# EAGLE design LEDARRAY (EAGLE 8.6.0)
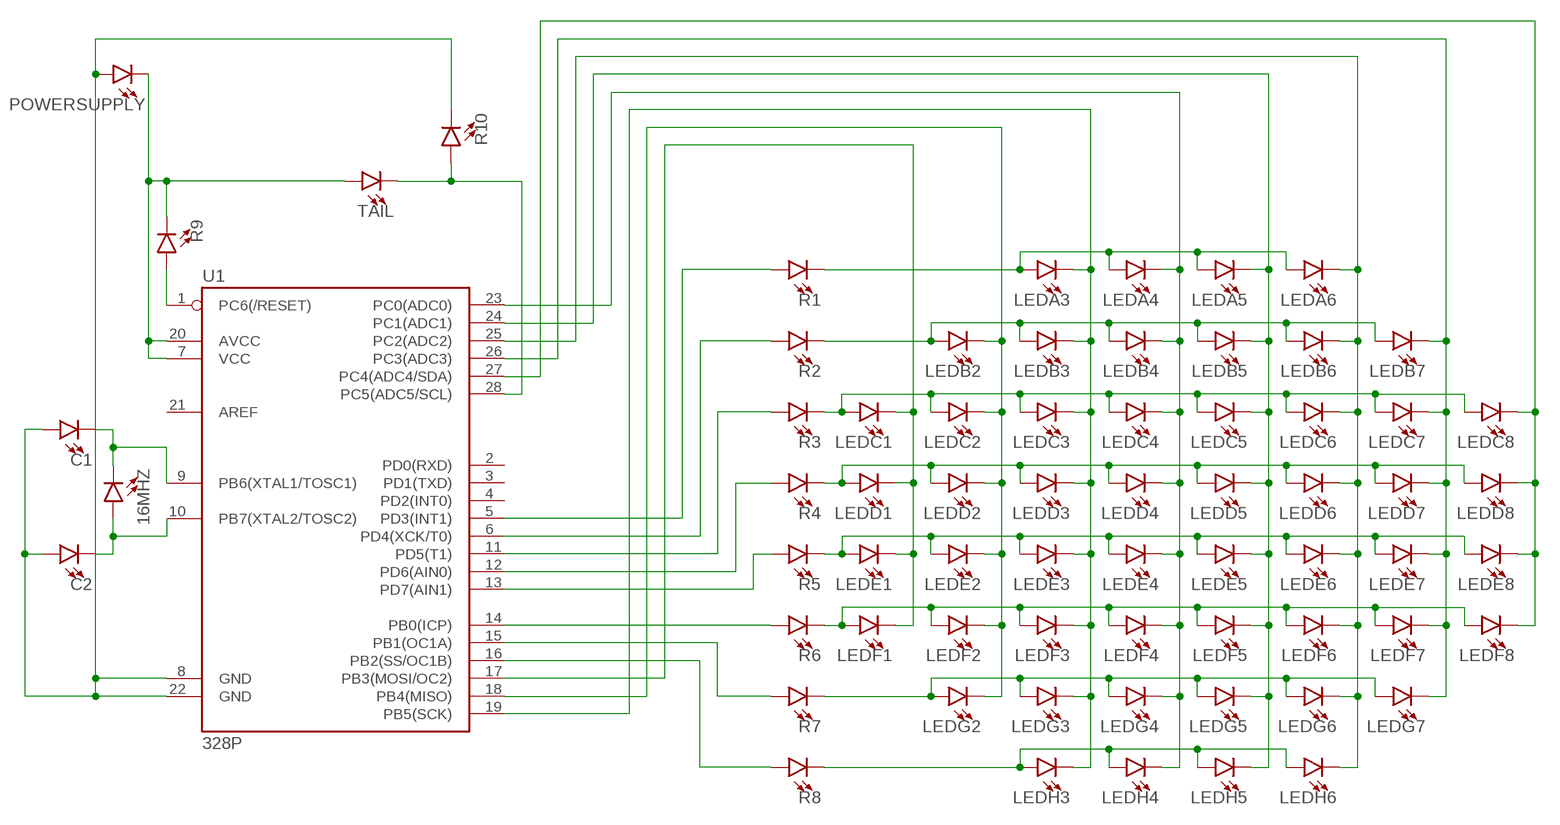
[diagram p0: schematic, sheet 1]

## Parts
16MHZ  LED3MM  [LED_3MM]
C1  LED3MM  [LED_3MM]
C2  LED3MM  [LED_3MM]
LEDA3  LED3MM  [LED_3MM]
LEDA4  LED3MM  [LED_3MM]
LEDA5  LED3MM  [LED_3MM]
LEDA6  LED3MM  [LED_3MM]
LEDB2  LED3MM  [LED_3MM]
LEDB3  LED3MM  [LED_3MM]
LEDB4  LED3MM  [LED_3MM]
LEDB5  LED3MM  [LED_3MM]
LEDB6  LED3MM  [LED_3MM]
LEDB7  LED3MM  [LED_3MM]
LEDC1  LED3MM  [LED_3MM]
LEDC2  LED3MM  [LED_3MM]
LEDC3  LED3MM  [LED_3MM]
LEDC4  LED3MM  [LED_3MM]
LEDC5  LED3MM  [LED_3MM]
LEDC6  LED3MM  [LED_3MM]
LEDC7  LED3MM  [LED_3MM]
LEDC8  LED3MM  [LED_3MM]
LEDD1  LED3MM  [LED_3MM]
LEDD2  LED3MM  [LED_3MM]
LEDD3  LED3MM  [LED_3MM]
LEDD4  LED3MM  [LED_3MM]
LEDD5  LED3MM  [LED_3MM]
LEDD6  LED3MM  [LED_3MM]
LEDD7  LED3MM  [LED_3MM]
LEDD8  LED3MM  [LED_3MM]
LEDE1  LED3MM  [LED_3MM]
LEDE2  LED3MM  [LED_3MM]
LEDE3  LED3MM  [LED_3MM]
LEDE4  LED3MM  [LED_3MM]
LEDE5  LED3MM  [LED_3MM]
LEDE6  LED3MM  [LED_3MM]
LEDE7  LED3MM  [LED_3MM]
LEDE8  LED3MM  [LED_3MM]
LEDF1  LED3MM  [LED_3MM]
LEDF2  LED3MM  [LED_3MM]
LEDF3  LED3MM  [LED_3MM]
LEDF4  LED3MM  [LED_3MM]
LEDF5  LED3MM  [LED_3MM]
LEDF6  LED3MM  [LED_3MM]
LEDF7  LED3MM  [LED_3MM]
LEDF8  LED3MM  [LED_3MM]
LEDG2  LED3MM  [LED_3MM]
LEDG3  LED3MM  [LED_3MM]
LEDG4  LED3MM  [LED_3MM]
LEDG5  LED3MM  [LED_3MM]
LEDG6  LED3MM  [LED_3MM]
LEDG7  LED3MM  [LED_3MM]
LEDH3  LED3MM  [LED_3MM]
LEDH4  LED3MM  [LED_3MM]
LEDH5  LED3MM  [LED_3MM]
LEDH6  LED3MM  [LED_3MM]
POWERSUPPLY  LED3MM  [LED_3MM]
R1  LED3MM  [LED_3MM]
R2  LED3MM  [LED_3MM]
R3  LED3MM  [LED_3MM]
R4  LED3MM  [LED_3MM]
R5  LED3MM  [LED_3MM]
R6  LED3MM  [LED_3MM]
R7  LED3MM  [LED_3MM]
R8  LED3MM  [LED_3MM]
R9  LED3MM  [LED_3MM]
R10  LED3MM  [LED_3MM]
TAIL  LED3MM  [LED_3MM]
U1  328P  ATMEGA328P_PDIP  [DIP28]

## Nets
LEDD1: LEDC1.K(C) LEDD1.K(C) LEDE1.K(C) LEDF1.K(C) U1.17(PB3(MOSI/OC2))
N$1: R8.A U1.16(PB2(SS/OC1B))
N$2: LEDG2.A LEDG3.A LEDG4.A LEDG5.A LEDG6.A LEDG7.A R7.K(C)
N$3: LEDF1.A LEDF2.A LEDF3.A LEDF4.A LEDF5.A LEDF6.A LEDF7.A LEDF8.A R6.K(C)
N$4: LEDH3.A LEDH4.A LEDH5.A LEDH6.A R8.K(C)
N$5: LEDD1.A LEDD2.A LEDD3.A LEDD4.A LEDD5.A LEDD6.A LEDD7.A LEDD8.A R4.K(C)
N$6: LEDE1.A LEDE2.A LEDE3.A LEDE4.A LEDE5.A LEDE6.A LEDE7.A LEDE8.A R5.K(C)
N$8: LEDA6.K(C) LEDB6.K(C) LEDC6.K(C) LEDD6.K(C) LEDE6.K(C) LEDF6.K(C) LEDG6.K(C) LEDH6.K(C) U1.25(PC2(ADC2))
N$9: LEDB2.K(C) LEDC2.K(C) LEDD2.K(C) LEDE2.K(C) LEDF2.K(C) LEDG2.K(C) U1.18(PB4(MISO))
N$10: R7.A U1.15(PB1(OC1A))
N$11: LEDA3.K(C) LEDB3.K(C) LEDC3.K(C) LEDD3.K(C) LEDE3.K(C) LEDF3.K(C) LEDG3.K(C) LEDH3.K(C) U1.19(PB5(SCK))
N$12: LEDB2.A LEDB3.A LEDB4.A LEDB5.A LEDB6.A LEDB7.A R2.K(C)
N$14: LEDA5.K(C) LEDB5.K(C) LEDC5.K(C) LEDD5.K(C) LEDE5.K(C) LEDF5.K(C) LEDG5.K(C) LEDH5.K(C) U1.24(PC1(ADC1))
N$15: R6.A U1.14(PB0(ICP))
N$16: 16MHZ.K(C) C1.K(C) U1.9(PB6(XTAL1/TOSC1))
N$17: R9.A U1.1(PC6(/RESET))
N$18: R5.A U1.13(PD7(AIN1))
N$19: R4.A U1.12(PD6(AIN0))
N$20: LEDB7.K(C) LEDC7.K(C) LEDD7.K(C) LEDE7.K(C) LEDF7.K(C) LEDG7.K(C) U1.26(PC3(ADC3))
N$21: LEDC1.A LEDC2.A LEDC3.A LEDC4.A LEDC5.A LEDC6.A LEDC7.A LEDC8.A R3.K(C)
N$22: LEDC8.K(C) LEDD8.K(C) LEDE8.K(C) LEDF8.K(C) U1.27(PC4(ADC4/SDA))
N$23: R2.A U1.6(PD4(XCK/T0))
N$24: R1.A U1.5(PD3(INT1))
N$25: R10.A TAIL.K(C) U1.28(PC5(ADC5/SCL))
N$26: POWERSUPPLY.K(C) R9.K(C) TAIL.A U1.7(VCC) U1.20(AVCC)
N$27: LEDA4.K(C) LEDB4.K(C) LEDC4.K(C) LEDD4.K(C) LEDE4.K(C) LEDF4.K(C) LEDG4.K(C) LEDH4.K(C) U1.23(PC0(ADC0))
N$28: 16MHZ.A C2.K(C) U1.10(PB7(XTAL2/TOSC2))
N$30: R3.A U1.11(PD5(T1))
N$32: LEDA3.A LEDA4.A LEDA5.A LEDA6.A R1.K(C)
POWERSUPPLY: C1.A C2.A POWERSUPPLY.A R10.K(C) U1.8(GND) U1.22(GND)
Unconnected: U1.2(PD0(RXD)) U1.3(PD1(TXD)) U1.4(PD2(INT0)) U1.21(AREF)

## Library data of the parts
16MHZ C1 C2 LEDA3-LEDA6 LEDB2-LEDB7 LEDC1-LEDC8 LEDD1-LEDD8 LEDE1-LEDE8 LEDF1-LEDF8 LEDG2-LEDG7 LEDH3-LEDH6 POWERSUPPLY R1-R10 TAIL = SparkFun-LED:LED: LED (Generic) Standard schematic elements and footprints for 5mm, 3mm, 1206, and 0603 sized LEDs. Generic LEDs with no color specified.; PROD_ID: DIO-08794
U1 = SparkFun-IC-Microcontroller:ATMEGA328P_PDIP: Atmel 328P Through hole ATMEGA328P uC used in the Arduino 32kb flash, 1k EEPROM, 2k SRAM Datasheet <http://www.sparkfun.com/datasheets/Components/SMD/ATMega328.pdf> SparkFun Products Storefront component: AVR 28 Pin 20MHz 32K 6A/D - ATMega328P <https://www.sparkfun.com/products/9061> (COM-09061) SparkFun Simon Says - Through-Hole Soldering Kit <https://www.sparkfun.com/products/10547> (KIT-10547) SparkFun Learn to Solder - Simon Says <https://www.sparkfun.com/products/13708> (KIT-13708) SparkFun BigTime Watch Kit <https://www.sparkfun.com/products/11734> (KIT-11734) SparkFun ClockIt <https://www.sparkfun.com/products/10930> (KIT-10930) SparkFun Serial Enabled LCD Kit <https://www.sparkfun.com/products/10097> (LCD-10097) SparkFun Simon Tilts - Through Hole Soldering Kit <https://www.sparkfun.com/products/12634> (KIT-12634) SparkFun Frequency Counter Kit <https://www.sparkfun.com/products/10140> (KIT-10140) FabFM Radio Kit <https://www.sparkfun.com/products/11043> (KIT-11043) SparkFun Binary Blaster Kit <https://www.sparkfun.com/products/12037> (KIT-12037) SparkFun Metro-Gnome <https://www.sparkfun.com/products/9236> (KIT-09236) ATmega328 with Arduino Optiboot (Uno) <https://www.sparkfun.com/products/10524> (DEV-10524); PROD_ID: IC-09136

## Board
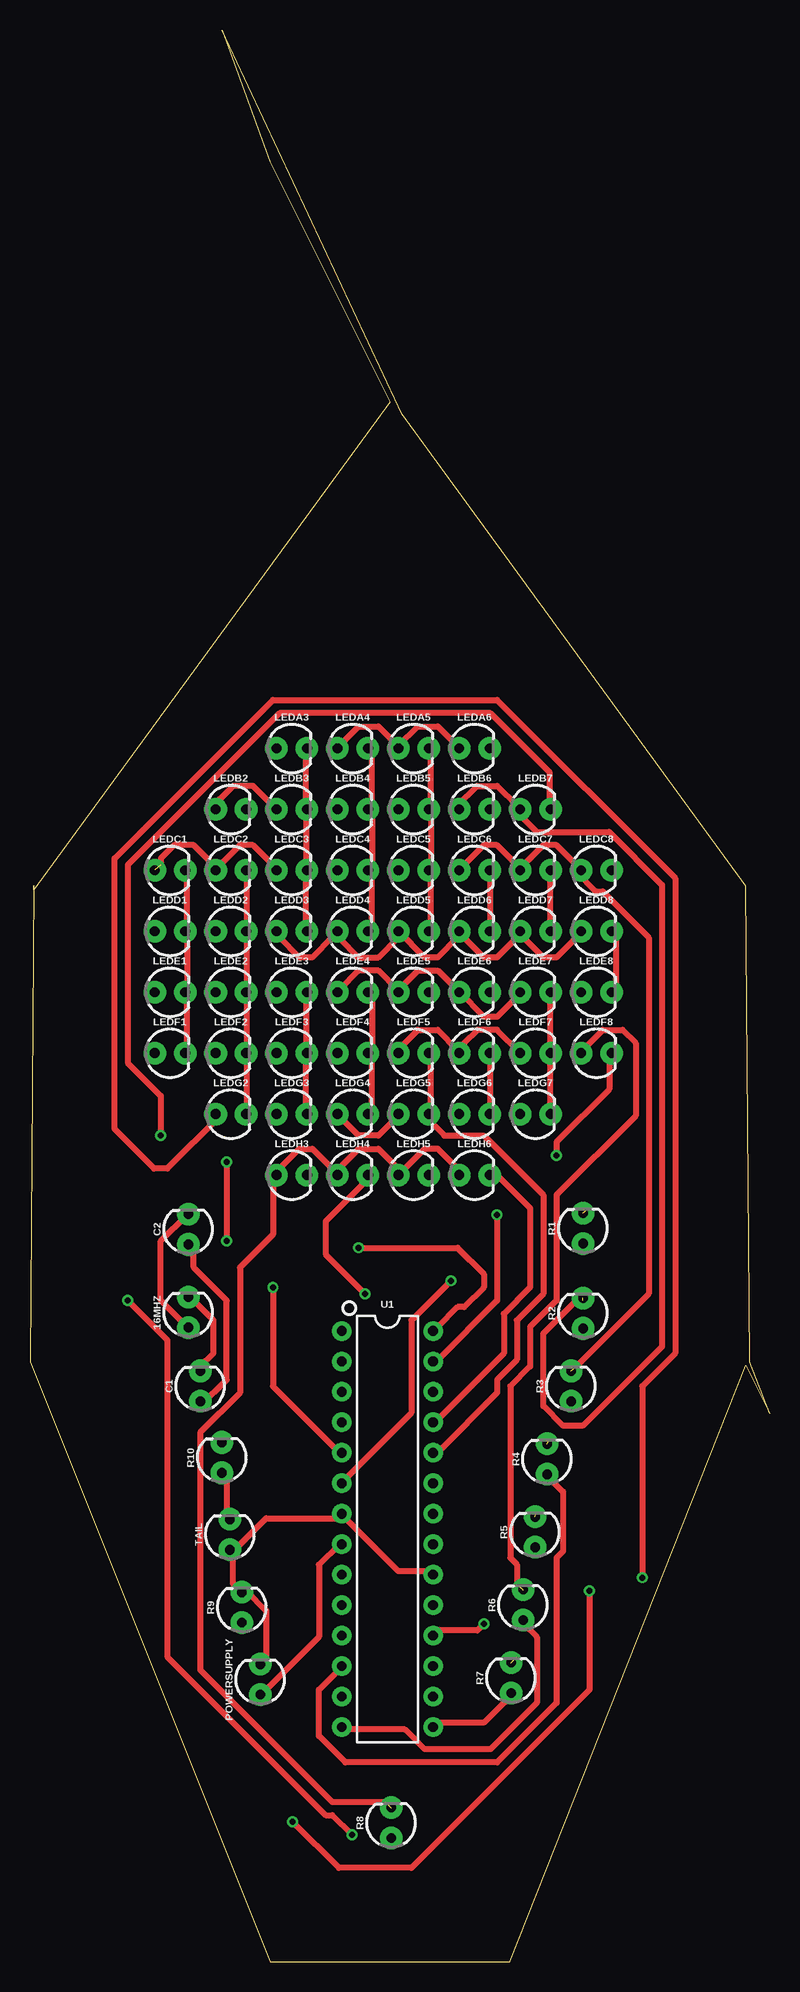
[diagram p1: board, top side]
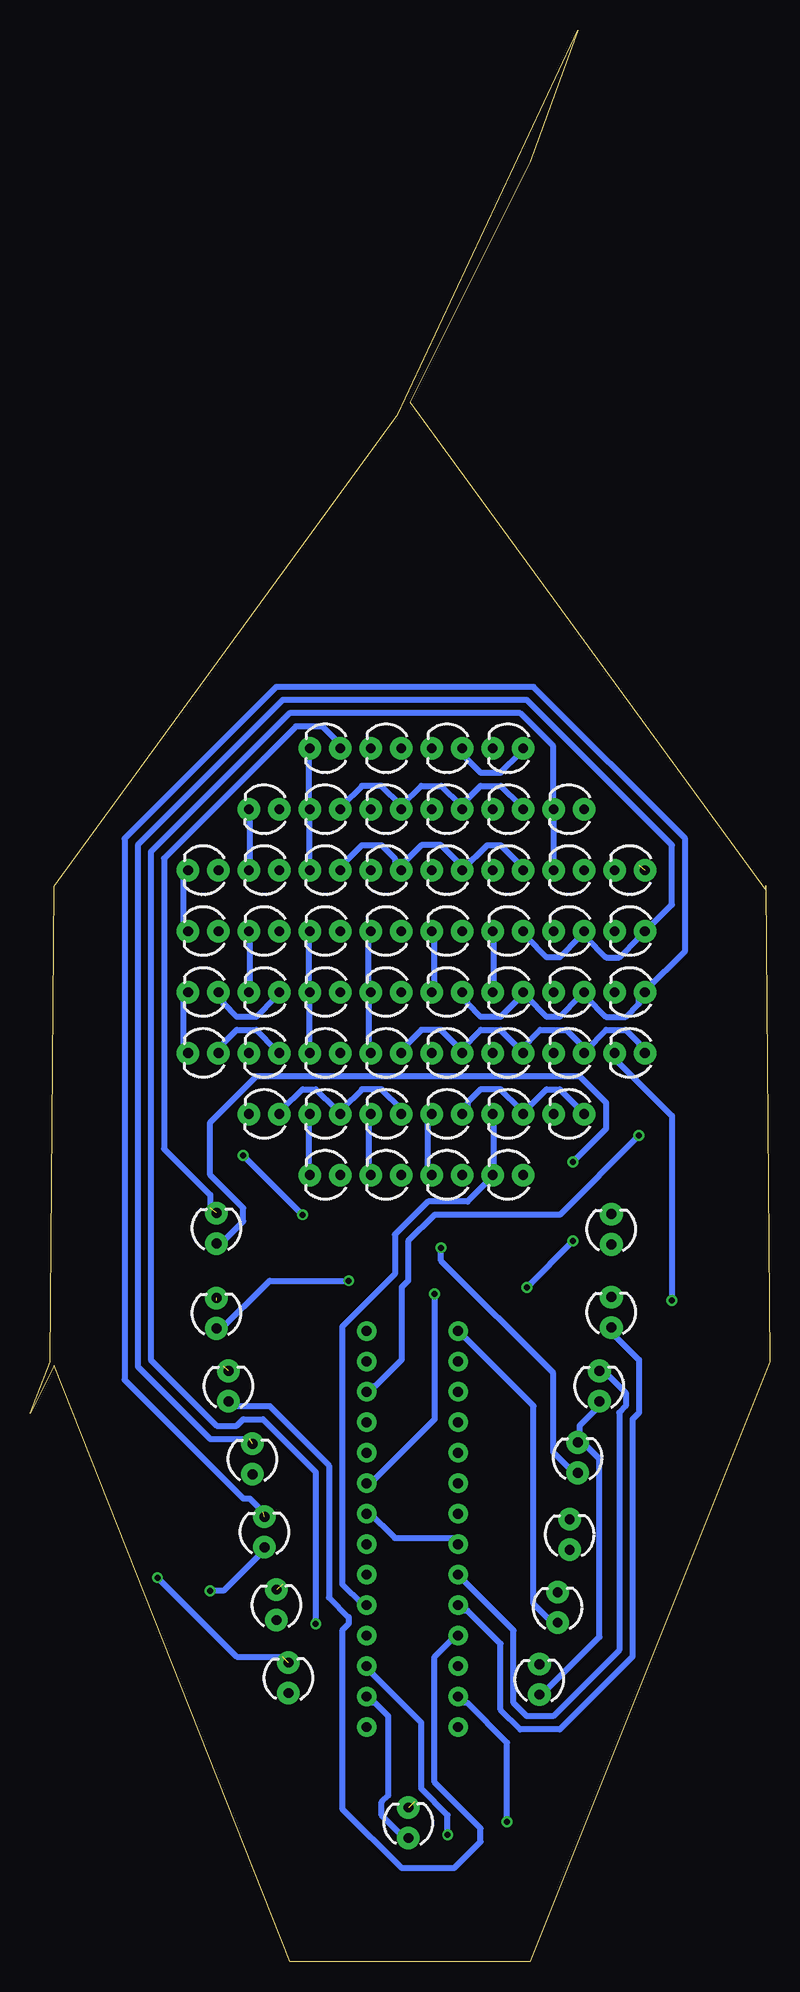
[diagram p2: board, bottom side, seen from below]

Size 61.68 x 161 mm. Coordinates in mm from the lower left corner, seen from the top.
Outline: 0.32,89.7 0,50 20,0 40,0 59.68,49.68 61.68,45.68 60,50 59.68,89.65 31,129 16,161 20,150 30,130 0.32,89.32 0.32,89.7
Copper layers (1*16): Top 0.035mm / dielectric 1.5mm / Bottom 0.035mm
Design rules "default *": minimum track width 0.5mm, minimum drill 0.5mm, track to track 0.6mm, track to pad 0.6mm, pad to pad 0.6mm, via to via 1.5mm, smd to smd 1mm, copper to edge 40mil, drill to drill 6mil, minimum pad ring 10mil, minimum via ring 8mil, stop-mask expansion 4mil, vias tented up to drill 0mil, thermal gap 10mil

### Footprints (pad centres in the part's own frame; a part is rotated, then mirrored left to right if it is on the bottom)
LED_3MM = drill 0.813 pad 1.88: A -1.27,0; K 1.27,0
DIP28 = drill 0.813 pad 1.626: 1 -16.51,-3.81; 2 -13.97,-3.81; 3 -11.43,-3.81; 4 -8.89,-3.81; 5 -6.35,-3.81; 6 -3.81,-3.81; 7 -1.27,-3.81; 8 1.27,-3.81; 9 3.81,-3.81; 10 6.35,-3.81; 11 8.89,-3.81; 12 11.43,-3.81; 13 13.97,-3.81; 14 16.51,-3.81; 15 16.51,3.81; 16 13.97,3.81; 17 11.43,3.81; 18 8.89,3.81; 19 6.35,3.81; 20 3.81,3.81; 21 1.27,3.81; 22 -1.27,3.81; 23 -3.81,3.81; 24 -6.35,3.81; 25 -8.89,3.81; 26 -11.43,3.81; 27 -13.97,3.81; 28 -16.51,3.81

### Placement (x,y rotation side)
16MHZ  13.2,54.12 90 top
C1  14.2,47.96 90 top
C2  13.2,61.04 90 top
LEDA3  21.83,101.12 0 top
LEDA4  26.91,101.12 0 top
LEDA5  31.99,101.12 0 top
LEDA6  37.07,101.12 0 top
LEDB2  16.75,96.04 0 top
LEDB3  21.83,96.04 0 top
LEDB4  26.91,96.04 0 top
LEDB5  31.99,96.04 0 top
LEDB6  37.07,96.04 0 top
LEDB7  42.15,96.04 0 top
LEDC1  11.67,90.96 0 top
LEDC2  16.75,90.96 0 top
LEDC3  21.83,90.96 0 top
LEDC4  26.91,90.96 0 top
LEDC5  31.99,90.96 0 top
LEDC6  37.07,90.96 0 top
LEDC7  42.15,90.96 0 top
LEDC8  47.23,90.96 0 top
LEDD1  11.67,85.88 0 top
LEDD2  16.75,85.88 0 top
LEDD3  21.83,85.88 0 top
LEDD4  26.91,85.88 0 top
LEDD5  31.99,85.88 0 top
LEDD6  37.07,85.88 0 top
LEDD7  42.15,85.88 0 top
LEDD8  47.23,85.88 0 top
LEDE1  11.67,80.8 0 top
LEDE2  16.75,80.8 0 top
LEDE3  21.83,80.8 0 top
LEDE4  26.91,80.8 0 top
LEDE5  31.99,80.8 0 top
LEDE6  37.07,80.8 0 top
LEDE7  42.15,80.8 0 top
LEDE8  47.23,80.8 0 top
LEDF1  11.67,75.72 0 top
LEDF2  16.75,75.72 0 top
LEDF3  21.83,75.72 0 top
LEDF4  26.91,75.72 0 top
LEDF5  31.99,75.72 0 top
LEDF6  37.07,75.72 0 top
LEDF7  42.15,75.72 0 top
LEDF8  47.23,75.72 0 top
LEDG2  16.75,70.64 0 top
LEDG3  21.83,70.64 0 top
LEDG4  26.91,70.64 0 top
LEDG5  31.99,70.64 0 top
LEDG6  37.07,70.64 0 top
LEDG7  42.15,70.64 0 top
LEDH3  21.83,65.56 0 top
LEDH4  26.91,65.56 0 top
LEDH5  31.99,65.56 0 top
LEDH6  37.07,65.56 0 top
POWERSUPPLY  19.2,23.51 90 top
R1  46.12,61.12 90 top
R2  46.12,54.04 90 top
R3  45.12,47.96 90 top
R4  43.12,41.88 90 top
R5  42.12,35.8 90 top
R6  41.12,29.72 90 top
R7  40.12,23.64 90 top
R8  30.12,11.56 90 top
R9  17.67,29.51 90 top
R10  16,42 90 top
TAIL  16.67,35.59 90 top
U1  29.8,36.05 270 top

### Tracks (layer width: path | path; a pad name or v marks a point on that pad's centre or on a via)
LEDD1  (via drill 0.5)
  Top 0.5: LEDC1.K 13.1,90.85 13.1,85.9 LEDD1.K 13.1,85.35 13.1,80.95 LEDE1.K 13.1,80.4 13.1,76 LEDF1.K | v26.85,10.55 25.2,12.2 24.65,12.2 11.45,25.4 11.45,51.8 v8.15,55.1
  Bottom 0.5: v26.85,10.55 26.85,12.2 29.05,14.4 29.05,19.9 33.45,24.3 U1.17 | v8.15,55.1 8.15,70.5 13.1,75.45 LEDF1.K
N$1
  Bottom 0.5: U1.16 33.45,21.55 32.9,21.55 31.8,20.45 31.8,13.85 32.35,13.3 32.35,12.2 30.15,10 R8.A
N$2  (via drill 0.5)  (1 unrouted)
  Top 0.5: LEDG4.A 25.75,70.5 27.4,68.85 29.05,68.85 30.7,70.5 LEDG5.A | v51.05,32 51.05,47.95 53.8,50.7 53.8,90.3 38.95,105.15 20.25,105.15 7.05,91.95 7.05,69.4 10.35,66.1 11.45,66.1 15.85,70.5 LEDG2.A
  Bottom 0.5: LEDG7.A 40.6,71.05 38.95,72.7 37.85,72.7 36.2,71.05 LEDG6.A 35.65,71.05 34,72.7 32.35,72.7 30.7,71.05 LEDG5.A | LEDG2.A 15.85,71.05 17.5,72.7 18.6,72.7 20.25,71.05 LEDG3.A 20.8,71.05 22.45,72.7 24.1,72.7 25.2,71.6 25.2,71.05 LEDG4.A | 40.6,25.4 44.45,25.4 v51.05,32
N$3  (1 unrouted)
  Top 0.5: LEDF5.A 30.7,76 32.35,77.65 34,77.65 35.65,76 LEDF6.A 36.2,76 36.2,76.55 37.3,77.65 38.95,77.65 LEDF7.A | 40.6,31.45 40.6,33.1 40.05,33.65 40.05,47.95 41.7,49.6 41.7,52.9 43.9,55.1 43.9,63.9 50.5,70.5 50.5,76.55 49.4,77.65 47.75,77.65 46.1,76 LEDF8.A
  Bottom 0.5: LEDF1.A 10.9,76 10.9,76.55 12,77.65 13.65,77.65 15.3,76 LEDF2.A 15.85,76 15.85,76.55 16.95,77.65 19.15,77.65 20.8,76 | 20.8,76 22.45,77.65 24.1,77.65 25.75,76 | 25.75,76 27.4,77.65 29.05,77.65 30.7,76 LEDF5.A | 25.75,76 LEDF4.A | 20.8,76 LEDF3.A | LEDF7.A 41.15,76 42.8,77.65 44.45,77.65 46.1,76 LEDF8.A
N$4  (1 unrouted)
  Top 0.5: LEDH6.A 35.65,66.1 34,67.75 32.9,67.75 31.25,66.1 LEDH5.A 30.7,66.1 29.05,67.75 27.4,67.75 25.75,66.1 LEDH4.A 25.2,66.1 23.55,67.75 22.45,67.75 20.8,66.1 LEDH3.A 20.25,65.55 20.25,60.6 17.5,57.85 17.5,47.4 14.2,44.1 14.2,24.3 25.2,13.3 29.6,13.3
N$5  (1 unrouted)
  Top 0.5: LEDD8.A 45.55,85.35 43.9,83.7 42.8,83.7 41.15,85.35 LEDD7.A 40.6,85.35 38.95,83.7 37.85,83.7 36.2,85.35 LEDD6.A 35.65,85.35 34,83.7 32.9,83.7 LEDD5.A 30.7,85.35 29.05,83.7 27.4,83.7 25.75,85.35 LEDD4.A 25.2,85.35 23.55,83.7 22.45,83.7 20.8,85.35 LEDD3.A
  Bottom 0.5: 43.35,43.55 46.65,43.55 52.7,49.6 52.7,93.05 40.6,105.15 20.25,105.15 8.15,93.05 8.15,88.1 10.35,85.9 LEDD1.A 10.9,85.35 12.55,83.7 13.65,83.7 15.3,85.35 LEDD2.A 15.85,85.35 17.5,83.7 18.6,83.7 20.25,85.35 LEDD3.A
N$6  (1 unrouted)
  Top 0.5: LEDE7.A 40.6,80.4 38.95,78.75 37.85,78.75 LEDE6.A 34,82.6 32.35,82.6 30.7,80.95 | 30.7,80.95 29.05,82.6 27.4,82.6 25.75,80.95 LEDE4.A | 30.7,80.95 LEDE5.A
  Bottom 0.5: LEDE8.A 45.55,80.4 45.55,79.85 44.45,78.75 42.8,78.75 41.15,80.4 LEDE7.A | 42.25,37.5 43.35,38.6 43.9,38.6 53.8,48.5 53.8,93.6 41.15,106.25 19.7,106.25 7.05,93.6 7.05,84.25 10.35,80.95 LEDE1.A 10.9,80.4 10.9,79.85 12,78.75 13.65,78.75 15.3,80.4 LEDE2.A 15.85,80.4 17.5,78.75 18.6,78.75 20.25,80.4 LEDE3.A 20.8,80.4 22.45,78.75 24.1,78.75 25.2,79.85 25.2,80.4 LEDE4.A
N$8
  Top 0.5: U1.25 34,45.2 39.5,50.7 39.5,54 41.7,56.2 41.7,62.8 38.4,66.1 LEDH6.K | LEDF6.K 38.4,75.45 38.4,71.05 LEDG6.K | LEDC6.K 38.4,90.85 38.4,85.9 LEDD6.K
  Bottom 0.5: LEDC6.K 38.4,91.4 38.4,95.8 LEDB6.K 38.4,96.35 38.4,100.75 LEDA6.K | LEDF6.K 38.4,76 38.4,80.4 LEDE6.K 38.4,80.95 38.4,85.35 LEDD6.K | LEDG6.K 38.4,70.5 38.4,66.1 LEDH6.K
N$9  (via drill 0.5)
  Top 0.5: LEDG2.K 18.05,71.05 18.05,75.45 LEDF2.K 18.05,76 18.05,80.4 LEDE2.K 18.05,80.95 18.05,85.35 LEDD2.K 18.05,85.9 18.05,90.85 LEDC2.K | v37.85,28.15 37.3,27.6 34,27.6 U1.18
  Bottom 0.5: v37.85,28.15 37.85,40.8 42.25,45.2 43.9,45.2 44.45,44.65 46.1,44.65 51.6,50.15 51.6,92.5 40.05,104.05 20.8,104.05 18.05,101.3 18.05,96.35 LEDB2.K 18.05,95.8 18.05,91.4 LEDC2.K
N$10
  Top 0.5: U1.15 34,19.9 37.85,19.9 40.05,22.1 R7.A
N$11
  Top 0.5: LEDA3.K 23,100.75 23,96.35 LEDB3.K 23,95.8 23,91.4 LEDC3.K 23,90.85 23,85.9 LEDD3.K | LEDE3.K 23,80.4 23,76 LEDF3.K 23,75.45 23,71.05 LEDG3.K
  Bottom 0.5: LEDD3.K 23,85.35 23,80.95 LEDE3.K | U1.19 34,29.8 35.65,31.45 35.65,52.9 31.25,57.3 31.25,60.6 28.5,63.35 25.2,63.35 23,65.55 LEDH3.K 23,66.1 23,70.5 LEDG3.K
N$12  (1 unrouted)
  Top 0.5: LEDB3.A 18.6,98 16.95,98 15.85,96.9 15.85,96.35 LEDB2.A | LEDB6.A 35.65,96.35 37.3,98 38.95,98 40.6,96.35 LEDB7.A 40.6,95.8 42.25,94.15 48.3,94.15 52.7,89.75 52.7,51.25 46.1,44.65 44.45,44.65 42.8,46.3 42.8,52.35 45.55,55.1 46.1,55.1
  Bottom 0.5: 25.75,96.35 27.4,98 29.05,98 30.7,96.35 | 30.7,96.35 32.35,98 34,98 35.65,96.35 LEDB6.A | 30.7,96.35 LEDB5.A | 25.75,96.35 24.1,98 22.45,98 20.8,96.35 LEDB3.A | 25.75,96.35 LEDB4.A
N$14
  Top 0.5: LEDA5.K 33.45,100.75 33.45,96.35 LEDB5.K 33.45,95.8 33.45,91.4 LEDC5.K 33.45,90.85 33.45,85.9 LEDD5.K | U1.24 34,42.45 38.95,47.4 38.95,48.5 40.6,50.15 40.6,53.45 42.8,55.65 42.8,63.9 37.85,68.85 34.55,68.85 32.9,70.5 LEDG5.K 33.45,71.05 33.45,75.45 LEDF5.K
  Bottom 0.5: LEDF5.K 33.45,76 33.45,80.4 LEDE5.K 33.45,80.95 33.45,85.35 LEDD5.K | LEDH5.K 33.45,66.1 33.45,70.5 LEDG5.K
N$15
  Top 0.5: U1.14 26.3,19.35 31.25,19.35 32.9,17.7 38.4,17.7 42.25,21.55 42.25,27.05 41.15,28.15 R6.A
N$16
  Top 0.5: 16MHZ.K 13.65,55.1 15.3,53.45 15.3,50.7 14.2,49.6 C1.K
  Bottom 0.5: U1.9 21.35,27.6 21.35,21.55 20.25,20.45 18.05,20.45 12.55,25.95 12.55,45.75 12,46.3 12,47.4 14.2,49.6 C1.K
N$17
  Bottom 0.5: U1.1 25.75,52.35 19.7,46.3 19.7,29.8 18.05,28.15 R9.A
N$18  (via drill 0.5)
  Top 0.5: v21.9,11.65 25.75,7.8 31.8,7.8 46.65,22.65 v46.65,30.9
  Bottom 0.5: v21.9,11.65 21.9,18.25 25.2,21.55 25.75,21.55 U1.13 | v46.65,30.9 45.55,30.9 42.25,34.2 R5.A
N$19
  Top 0.5: U1.12 25.75,24.3 24.1,22.65 24.1,18.8 26.3,16.6 38.95,16.6 43.9,21.55 43.9,33.65 44.45,34.2 44.45,39.15 43.35,40.25 R4.A
N$20  (via drill 0.5)
  Top 0.5: LEDG7.K 43.35,71.05 43.35,75.45 LEDF7.K 43.35,76 43.35,80.4 LEDE7.K | v10.9,68.85 10.9,72.15 8.15,74.9 8.15,91.4 20.8,104.05 38.4,104.05 43.35,99.1 43.35,96.35 LEDB7.K | LEDD7.K 43.35,85.9 43.35,90.85 LEDC7.K
  Bottom 0.5: LEDE7.K 43.35,80.95 43.35,85.35 LEDD7.K | v10.9,68.85 17.5,62.25 27.95,62.25 30.15,60.05 30.15,56.75 30.7,56.2 30.7,50.15 32.9,47.95 33.45,47.95 U1.26 | LEDC7.K 43.35,91.4 43.35,95.8 LEDB7.K
N$21  (2 unrouted)
  Top 0.5: 10.9,91.4 10.9,91.95 12,93.05 13.65,93.05 15.3,91.4 LEDC2.A 15.85,91.4 17.5,93.05 18.6,93.05 20.25,91.4 LEDC3.A | LEDC6.A 36.2,91.4 37.85,93.05 38.95,93.05 40.6,91.4 LEDC7.A 41.15,91.4 42.8,93.05 43.9,93.05 45.55,91.4 LEDC8.A 45.55,90.85 47.2,89.2 47.75,89.2 51.6,85.35 51.6,55.65 45.55,49.6
  Bottom 0.5: LEDC3.A 20.8,91.4 22.45,93.05 23.55,93.05 LEDC4.A 25.75,91.4 27.4,93.05 29.05,93.05 30.7,91.4 LEDC5.A 31.25,91.4 31.25,91.95 32.35,93.05 34,93.05 35.65,91.4 LEDC6.A
N$22  (via drill 0.5)
  Top 0.5: LEDE8.K 48.85,80.95 48.85,85.35 LEDD8.K | v38.95,62.25 38.95,55.1 34,50.15 U1.27 | v43.9,67.2 43.9,68.3 48.3,72.7 48.3,75.45 LEDF8.K
  Bottom 0.5: LEDC8.K 48.85,90.85 48.85,85.9 LEDD8.K | v43.9,67.2 v38.95,62.25 | LEDE8.K 48.85,80.4 48.85,76 LEDF8.K
N$23  (via drill 0.5)
  Top 0.5: v35.1,56.75 31.8,53.45 31.8,45.75 26.3,40.25 U1.6
  Bottom 0.5: v35.1,56.75 41.7,56.75 46.1,52.35 R2.A
N$24  (via drill 0.5)
  Top 0.5: v20.25,56.2 20.25,47.95 25.75,42.45 U1.5 | v16.4,66.65 v16.4,60.05
  Bottom 0.5: v16.4,60.05 v20.25,56.2 | v16.4,66.65 13.65,69.4 13.65,71.6 15.85,73.8 42.8,73.8 46.65,69.95 46.65,65.55 43.9,62.8 43.9,61.7 46.1,59.5 R1.A
N$25  (via drill 0.5)
  Top 0.5: v27.4,59.5 35.65,59.5 37.85,57.3 37.85,56.2 36.2,54.55 35.65,54.55 34,52.9 U1.28 | TAIL.K 16.4,36.95 16.4,40.25 R10.A
  Bottom 0.5: v27.4,59.5 27.4,58.4 18.05,49.05 18.05,42.45 16.4,40.8 R10.A
N$26
  Top 0.5: U1.20 33.45,32.55 30.7,32.55 26.3,36.95 U1.7 25.75,36.95 19.7,36.95 16.95,34.2 | 16.95,34.2 16.95,31.45 17.5,30.9 R9.K 18.05,30.9 19.7,29.25 19.7,24.85 POWERSUPPLY.K | 16.95,34.2 TAIL.A
N$27  (via drill 0.5)
  Top 0.5: LEDA4.K 28.5,100.75 28.5,96.35 LEDB4.K 28.5,95.8 28.5,91.4 LEDC4.K 28.5,90.85 28.5,85.9 LEDD4.K | LEDE4.K 28.5,80.4 28.5,76 LEDF4.K 28.5,75.45 28.5,71.05 LEDG4.K | v27.95,55.65 24.65,58.95 24.65,61.7 28.5,65.55 LEDH4.K
  Bottom 0.5: LEDD4.K 27.95,85.35 27.95,80.95 LEDE4.K | v27.95,55.65 27.95,45.2 32.9,40.25 33.45,40.25 U1.23 | LEDG4.K 28.5,70.5 28.5,66.1 LEDH4.K
N$28
  Top 0.5: C2.K 13.1,62.25 10.9,60.05 10.9,55.1 13.1,52.9 16MHZ.A
  Bottom 0.5: U1.10 25.75,29.25 25.2,29.25 22.45,26.5 22.45,21 20.8,19.35 17.5,19.35 11.45,25.4 11.45,45.2 10.9,45.75 10.9,50.15 13.1,52.35 16MHZ.A
N$30
  Bottom 0.5: U1.11 26.3,27.05 27.95,25.4 27.95,14.95 24.1,11.1 24.1,10 26.3,7.8 30.7,7.8 35.65,12.75 35.65,27.6 35.1,28.15 35.1,28.7 36.75,30.35 36.75,41.35 41.7,46.3 45,46.3 R3.A
N$32  (1 unrouted)
  Top 0.5: 30.7,101.3 29.05,102.95 27.4,102.95 25.75,101.3 LEDA4.A | 30.7,101.3 32.35,102.95 34,102.95 35.65,101.3 LEDA6.A | 30.7,101.3 LEDA5.A
  Bottom 0.5: LEDA3.A 20.8,100.75 22.45,99.1 24.1,99.1 25.75,100.75 LEDA4.A | 46.65,62.8 46.65,63.9 50.5,67.75 50.5,91.95 39.5,102.95 37.3,102.95 35.65,101.3 LEDA6.A
POWERSUPPLY
  Top 0.5: C2.A 13.65,59.5 13.65,57.85 16.4,55.1 16.4,48.5 14.2,46.3 C1.A | POWERSUPPLY.A 19.7,22.65 24.1,27.05 24.1,33.1 25.75,34.75 U1.8
  Bottom 0.5: C1.A 14.2,46.3 15.85,44.65 15.85,43.55 R10.K 15.85,43 15.3,43 14.2,41.9 14.2,27.05 19.15,22.1 POWERSUPPLY.A | U1.8 26.3,35.3 31.25,35.3 33.45,37.5 U1.22